# EAGLE design VNT (EAGLE 6.5.0)
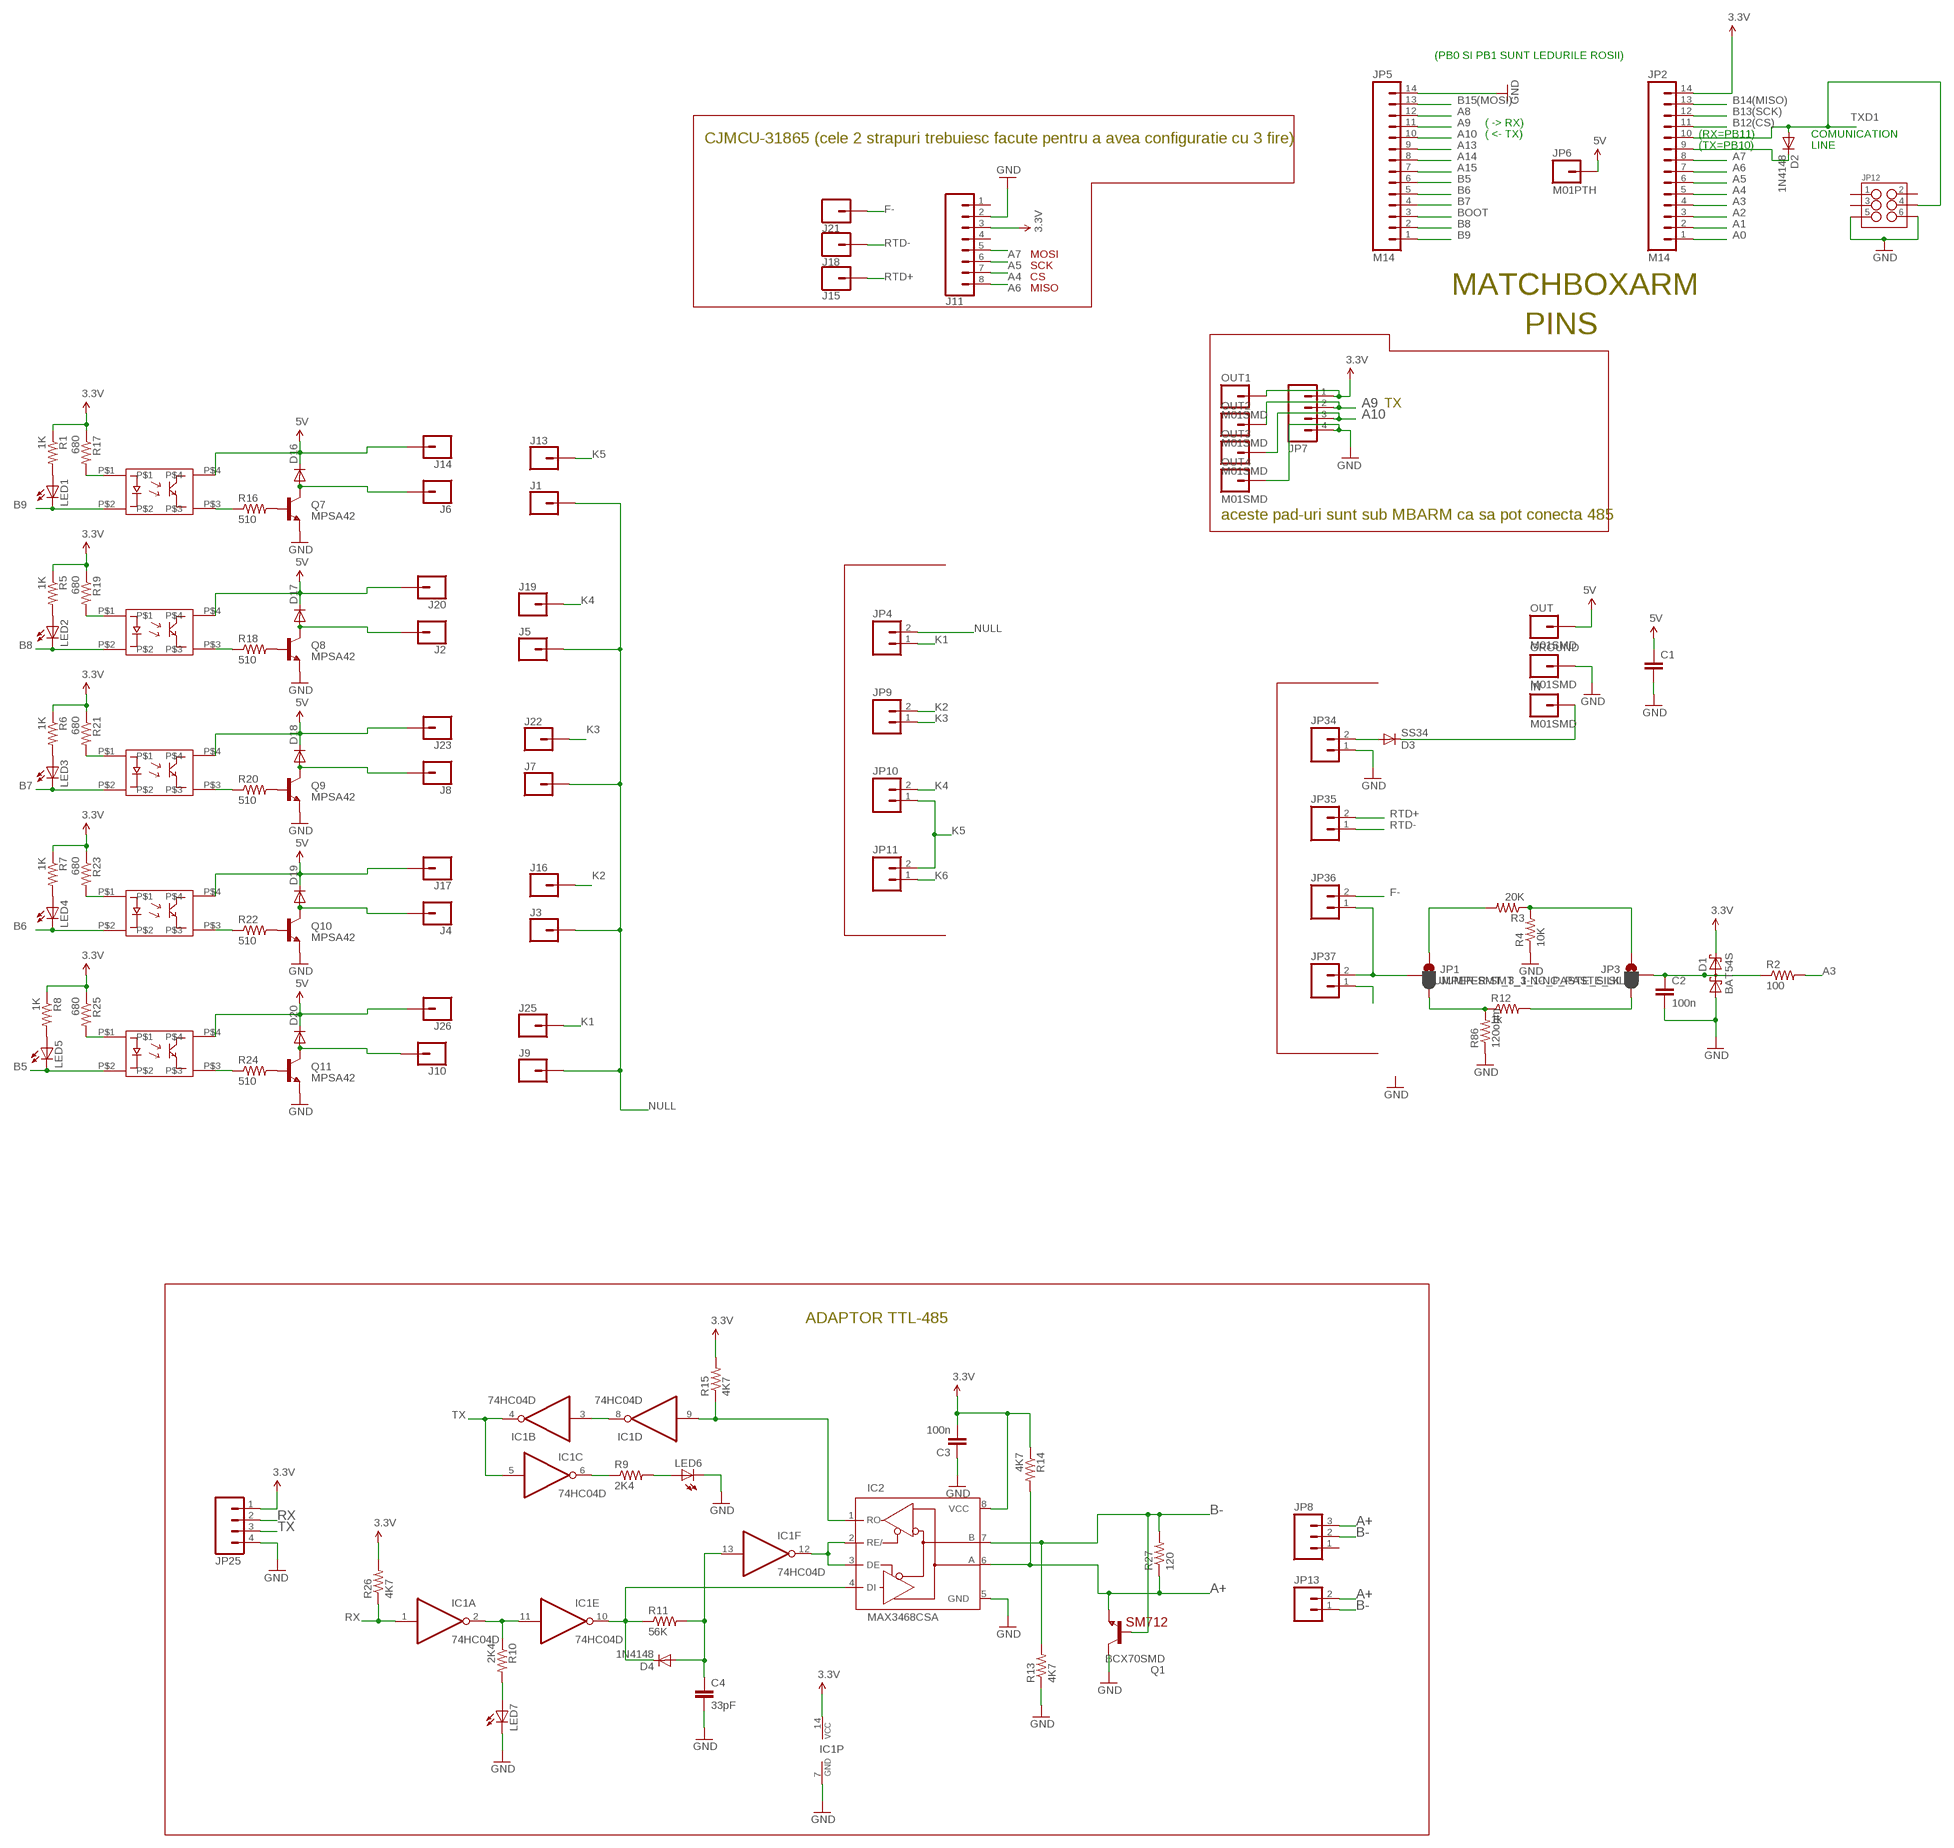
[diagram p0: schematic, sheet 1]

## Parts
C1  CAPPTH1  [CAP-PTH-5MM]
C2  100n  CAP0805  [0805]
C3  100n  CAP0805  [0805]
C4  33pF  CAP0805  [0805]
D1  BAT54S  [SOT23]
D2  1N4148  DIODE-MINIMELF  [MINIMELF]
D3  SS34  DIODE-SMC  [SMC]
D4  1N4148  DIODE-MINIMELF  [MINIMELF]
D16  DIODE-MINIMELF  [MINIMELF]
D17  DIODE-MINIMELF  [MINIMELF]
D18  DIODE-MINIMELF  [MINIMELF]
D19  DIODE-MINIMELF  [MINIMELF]
D20  DIODE-MINIMELF  [MINIMELF]
GROUND  M01SMD  [LUXEON-PAD]
IC1  74HC04D  [SO14]
IC2  MAX3468CSA  [SO08]
IN  M01SMD  [LUXEON-PAD]
J1  CONN_01  [1X01@2]
J2  CONN_01  [1X01@2]
J3  CONN_01  [1X01@2]
J4  CONN_01  [1X01@2]
J5  CONN_01  [1X01@2]
J6  CONN_01  [1X01@2]
J7  CONN_01  [1X01@2]
J8  CONN_01  [1X01@2]
J9  CONN_01  [1X01@2]
J10  CONN_01  [1X01@2]
J11  CONN_08LOCK  [1X08_LOCK]
J13  CONN_01  [1X01@2]
J14  CONN_01  [1X01@2]
J15  CONN_01  [1X01@2]
J16  CONN_01  [1X01@2]
J17  CONN_01  [1X01@2]
J18  CONN_01  [1X01@2]
J19  CONN_01  [1X01@2]
J20  CONN_01  [1X01@2]
J21  CONN_01  [1X01@2]
J22  CONN_01  [1X01@2]
J23  CONN_01  [1X01@2]
J25  CONN_01  [1X01@2]
J26  CONN_01  [1X01@2]
JP1  JUMPER-SMT_3_1-NC_PASTE_SILK  [SMT-JUMPER_3_1-NC_PASTE_SILK]
JP2  M14  [1X14]
JP3  JUMPER-SMT_3_1-NC_PASTE_SILK  [SMT-JUMPER_3_1-NC_PASTE_SILK]
JP4  M025MM  [SCREWTERMINAL-5MM-2]
JP5  M14  [1X14]
JP6  M01PTH  [1X01]
JP7  M04PTH  [1X04]
JP8  M03-SCREW-5MM  [SCREWTERMINAL-5MM-3]
JP9  M025MM  [SCREWTERMINAL-5MM-2]
JP10  M025MM  [SCREWTERMINAL-5MM-2]
JP11  M025MM  [SCREWTERMINAL-5MM-2]
JP12  M03X22X3_SILK_MALE_PTH  [2X3]
JP13  M025MM  [SCREWTERMINAL-5MM-2]
JP25  M04PTH  [1X04]
JP34  M025MM  [SCREWTERMINAL-5MM-2]
JP35  M025MM  [SCREWTERMINAL-5MM-2]
JP36  M025MM  [SCREWTERMINAL-5MM-2]
JP37  M025MM  [SCREWTERMINAL-5MM-2]
LED1  LEDCHIP-LED0805  [CHIP-LED0805]
LED2  LEDCHIP-LED0805  [CHIP-LED0805]
LED3  LEDCHIP-LED0805  [CHIP-LED0805]
LED4  LEDCHIP-LED0805  [CHIP-LED0805]
LED5  LEDCHIP-LED0805  [CHIP-LED0805]
LED6  LEDCHIP-LED0805  [CHIP-LED0805]
LED7  LEDCHIP-LED0805  [CHIP-LED0805]
OUT  M01SMD  [LUXEON-PAD]
OUT1  M01SMD  [LUXEON-PAD]
OUT2  M01SMD  [LUXEON-PAD]
OUT3  M01SMD  [LUXEON-PAD]
OUT4  M01SMD  [LUXEON-PAD]
Q1  BCX70SMD  [SOT23]
Q7  MPSA42  TRANSISTOR_NPNMPSA42  [SOT23-3]
Q8  MPSA42  TRANSISTOR_NPNMPSA42  [SOT23-3]
Q9  MPSA42  TRANSISTOR_NPNMPSA42  [SOT23-3]
Q10  MPSA42  TRANSISTOR_NPNMPSA42  [SOT23-3]
Q11  MPSA42  TRANSISTOR_NPNMPSA42  [SOT23-3]
R1  1K  RESISTOR0805-RES  [0805]
R2  100  RESISTOR0805-RES  [0805]
R3  20K  RESISTOR1206  [1206]
R4  10K  RESISTOR1206  [1206]
R5  1K  RESISTOR0805-RES  [0805]
R6  1K  RESISTOR0805-RES  [0805]
R7  1K  RESISTOR0805-RES  [0805]
R8  1K  RESISTOR0805-RES  [0805]
R9  2K4  RESISTOR0805-RES  [0805]
R10  2K4  RESISTOR0805-RES  [0805]
R11  56K  RESISTOR0805-RES  [0805]
R12  1k  RESISTOR0805-RES  [0805]
R13  4K7  RESISTOR0805-RES  [0805]
R14  4K7  RESISTOR0805-RES  [0805]
R15  4K7  RESISTOR0805-RES  [0805]
R16  510  RESISTOR0805-RES  [0805]
R17  680  RESISTOR0805-RES  [0805]
R18  510  RESISTOR0805-RES  [0805]
R19  680  RESISTOR0805-RES  [0805]
R20  510  RESISTOR0805-RES  [0805]
R21  680  RESISTOR0805-RES  [0805]
R22  510  RESISTOR0805-RES  [0805]
R23  680  RESISTOR0805-RES  [0805]
R24  510  RESISTOR0805-RES  [0805]
R25  680  RESISTOR0805-RES  [0805]
R26  4K7  RESISTOR0805-RES  [0805]
R27  120  RESISTOR0805-RES  [0805]
R86  120ohm  RESISTOR2010  [R2010]
U$13  IS181D-I  [TLP181-I]
U$14  IS181D-I  [TLP181-I]
U$15  IS181D-I  [TLP181-I]
U$16  IS181D-I  [TLP181-I]
U$17  IS181D-I  [TLP181-I]

## Nets
3.3V: C3.2 D1.2(C2) IC1.14(P:VCC) IC2.8(VCC) J11.3 JP2.14 JP7.1 JP25.1 OUT1.P$1 R1.1 R5.1 R6.1 R7.1 R8.1 R14.1 R15.2 R17.1 R19.1 R21.1 R23.1 R25.1 R26.2
5V: C1.1 D16.C D17.C D18.C D19.C D20.C J14.1 J17.1 J20.1 J23.1 J26.1 JP6.1 OUT.P$1 U$13.P$4 U$14.P$4 U$15.P$4 U$16.P$4 U$17.P$4
A0: JP2.1
A1: JP2.2
A2: JP2.3
A3: JP2.4 R2.2
A4: J11.7 JP2.5
A5: J11.6 JP2.6
A6: J11.8 JP2.7
A7: J11.5 JP2.8
A8: JP5.12
A9: JP5.11 JP7.2 OUT2.P$1
A10: JP5.10 JP7.3 OUT3.P$1
A13: JP5.9
A14: JP5.8
A15: JP5.7
A+: IC2.6(A) JP8.3 JP13.2 Q1.2(E) R14.2 R27.1
B5: JP5.6 LED5.C U$17.P$2
B6: JP5.5 LED4.C U$16.P$2
B7: JP5.4 LED3.C U$15.P$2
B8: JP5.2 LED2.C U$13.P$2
B9: JP5.1 LED1.C U$14.P$2
B12(CS): JP2.11
B13(SCK): JP2.12
B14(MISO): JP2.13
B15(MOSI): JP5.13
B-: IC2.7(B) JP8.2 JP13.1 Q1.1(B) R13.2 R27.2
BOOT: JP5.3
F-: J21.1 JP36.2
GND: C1.2 C2.2 C3.1 C4.2 D1.1(A1) GROUND.P$1 IC1.7(P:GND) IC2.5(GND) J11.2 JP5.14 JP7.4 JP12.5 JP12.6 JP25.4 JP34.1 LED6.C LED7.C OUT4.P$1 Q1.3(C) Q7.2(E) Q8.2(E) Q9.2(E) Q10.2(E) Q11.2(E) R4.1 R13.1 R86.1
K1: J25.1 JP4.1
K2: J16.1 JP9.2
K3: J22.1 JP9.1
K4: J19.1 JP10.2
K5: J13.1 JP10.1 JP11.2
K6: JP11.1
N$1: LED1.A R1.2
N$2: LED2.A R5.2
N$3: LED3.A R6.2
N$4: D3.A JP34.2
N$5: JP3.3 R12.2
N$6: JP3.1 R3.1 R4.2
N$7: C2.1 D1.3(C1A2) JP3.2 R2.1
N$8: JP1.1 R3.2
N$9: LED4.A R7.2
N$10: LED5.A R8.2
N$11: D3.C IN.P$1
N$12: JP37.1
N$16: LED7.A R10.2
N$17: LED6.A R9.2
N$19: IC1.2(A:O) IC1.11(E:I) R10.1
N$21: IC1.9(D:I) IC2.1(RO) R15.1
N$22: JP1.2 JP36.1 JP37.2
N$23: IC1.3(B:I) IC1.8(D:O)
N$24: C4.1 D4.A IC1.13(F:I) R11.2
N$27: IC1.6(C:O) R9.1
N$29: D4.C IC1.10(E:O) IC2.4(DI) R11.1
N$30: IC1.12(F:O) IC2.2(RE/) IC2.3(DE)
N$53: Q7.1(B) R16.2
N$54: D16.A J6.1 Q7.3(C)
N$55: Q8.1(B) R18.2
N$56: D17.A J2.1 Q8.3(C)
N$57: Q9.1(B) R20.2
N$58: D18.A J8.1 Q9.3(C)
N$59: Q10.1(B) R22.2
N$60: D19.A J4.1 Q10.3(C)
N$61: Q11.1(B) R24.2
N$62: D20.A J10.1 Q11.3(C)
N$77: R16.1 U$14.P$3
N$78: R17.2 U$14.P$1
N$80: R18.1 U$13.P$3
N$81: R20.1 U$15.P$3
N$82: R22.1 U$16.P$3
N$83: R24.1 U$17.P$3
N$85: R19.2 U$13.P$1
N$87: R21.2 U$15.P$1
N$89: R23.2 U$16.P$1
N$91: R25.2 U$17.P$1
N$104: JP1.3 R12.1 R86.2
NULL: J1.1 J3.1 J5.1 J7.1 J9.1 JP4.2
RTD+: J15.1 JP35.2
RTD-: J18.1 JP35.1
RX: IC1.1(A:I) JP25.2 R26.1
RXD1: D2.C JP2.9
TX: IC1.4(B:O) IC1.5(C:I) JP25.3
TXD1: D2.A JP2.10 JP12.4
Unconnected: J11.1 J11.4 JP8.1 JP12.1 JP12.2 JP12.3

## Notes on the sheet
- (PB0 SI PB1 SUNT LEDURILE ROSII)
- ( -> RX)
- ( <- TX) | (RX=PB11) | COMUNICATION
- CJMCU-31865 (cele 2 strapuri trebuiesc facute pentru a avea configuratie cu 3 fire)
- (TX=PB10) | LINE
- MOSI
- SCK
- CS
- MISO
- MATCHBOXARM
- PINS
- TX
- aceste pad-uri sunt sub MBARM ca sa pot conecta 485
- ADAPTOR TTL-485
- SM712

## Library data of the parts
C1-C4 = SparkFun-Passives:CAP: Capacitor Standard 0603 ceramic capacitor, and 0.1" leaded capacitor.
D1 = diode:BAT54S: Schottky Diodes Pin connection corrected 2011-05-04 Source: Fairchild .. BAT54.pdf
D2-D4 = diode:DIODE-: DIODE
D16-D20 = diode_NEDELCU:DIODE-: DIODE
GROUND IN JP6 OUT OUT1-OUT4 = SparkFun-Connectors:M01: Header 1 Standard 1-pin 0.1" header. Use with straight break away headers (SKU : PRT-00116), right angle break away headers (PRT-00553), swiss pins (PRT-00743), machine pins (PRT-00117), and female headers (PRT-00115).
IC1 = 74xx-eu:74*04: Hex INVERTER
IC2 = maxim:MAX34*: +5V, Fail-Safe, 40Mbps, Profibus RS-485/RS-422 Transceivers Source: MAX3465-MAX3469.pdf; MPN: MAX3468CSA+; OC_FARNELL: unknown; OC_NEWARK: 76K6721
J1-J10 J13-J23 J25 J26 = SparkFun-Connectors:CONN_01: Single connection point. Often used as Generic Header-pin footprint for 0.1 inch spaced/style header connections On any of the 0.1 inch spaced packages, you can populate with these: Break Away Headers - Straight <https://www.sparkfun.com/products/116> (PRT-00116) Break Away Male Headers - Right Angle <https://www.sparkfun.com/products/553> (PRT-00553) Female Headers <https://www.sparkfun.com/products/115> (PRT-00115) Break Away Headers - Machine Pin <https://www.sparkfun.com/products/117> (PRT-00117) Break Away Female Headers - Swiss Machine Pin <https://www.sparkfun.com/products/743> (PRT-00743) This device is also useful as a general connection point to wire up your design to another part of your project. Our various solder wires solder well into these plated through hole pads. Hook-Up Wire - Assortment (Stranded, 22 AWG) <https://www.sparkfun.com/products/11375> (PRT-11375) Hook-Up Wire - Assortment (Solid Core, 22 AWG) <https://www.sparkfun.com/products/11367> (PRT-11367) View the entire wire category on our website here <https://www.sparkfun.com/categories/141> Special notes: SMTSO-256-ET is a "flush mount" nut for a 4-40 screw. We mostly use this on specialty testbeds; it is a nice way to connect hardware to your PCB at an adjustable hieght. Also note, the SNAP packages are for using a snappable style connector. We sell a baggie of snaps and they are also used on two LilyPad designs: Snap Assortment - 30 pack (male and female) <https://www.sparkfun.com/products/11347> (DEV-11347) LilyPad Arduino SimpleSnap <https://www.sparkfun.com/products/10941> (DEV-10941) LilyPad SimpleSnap Protoboard <https://www.sparkfun.com/products/10940> (DEV-10940)
J11 = SparkFun-Connectors:CONN_08: Multi connection point. Often used as Generic Header-pin footprint for 0.1 inch spaced/style header connections On any of the 0.1 inch spaced packages, you can populate with these: Break Away Headers - Straight <https://www.sparkfun.com/products/116> (PRT-00116) Break Away Male Headers - Right Angle <https://www.sparkfun.com/products/553> (PRT-00553) Female Headers <https://www.sparkfun.com/products/115> (PRT-00115) Break Away Headers - Machine Pin <https://www.sparkfun.com/products/117> (PRT-00117) Break Away Female Headers - Swiss Machine Pin <https://www.sparkfun.com/products/743> (PRT-00743) Arduino Stackable Header - 8 Pin <https://www.sparkfun.com/products/9279> (PRT-09279) For SCREWTERMINALS and SPRING TERMINALS visit here: Screw Terimnals on SparkFun.com <https://www.sparkfun.com/search/results?term=Screw+Terminals> (5mm/3.5mm/2.54mm spacing) This device is also useful as a general connection point to wire up your design to another part of your project. Our various solder wires solder well into these plated through hole pads. Hook-Up Wire - Assortment (Stranded, 22 AWG) <https://www.sparkfun.com/products/11375> (PRT-11375) Hook-Up Wire - Assortment (Solid Core, 22 AWG) <https://www.sparkfun.com/products/11367> (PRT-11367) View the entire wire category on our website here <https://www.sparkfun.com/categories/141> Special notes: Molex polarized connector foot print use with SKU : PRT-08231 with associated crimp pins and housings. 1MM SMD Version SKU: PRT-10208 NOTES ON THE VARIANTS LOCK and LOCK_LONGPADS... This footprint was designed to help hold the alignment of a through-hole component (i.e. 6-pin header) while soldering it into place. You may notice that each hole has been shifted either up or down by 0.005 of an inch from it's more standard position (which is a perfectly straight line). This slight alteration caused the pins (the squares in the middle) to touch the edges of the holes. Because they are alternating, it causes a "brace" to hold the component in place. 0.005 has proven to be the perfect amount of "off-center" position when using our standard breakaway headers. Although looks a little odd when you look at the bare footprint, once you have a header in there, the alteration is very hard to notice. Also,if you push a header all the way into place, it is covered up entirely on the bottom side.
JP1 JP3 = SparkFun-Jumpers:JUMPER-SMT_3_1-NC_PASTE: Normally closed solder jumper (1 of 2 connections) This jumper has an aperture in the stencil to allow solder paste to bridge one of the two connections. One connection is normally closed (NC), while the other is normally open (NO). Wick off the solder to open the connection. Reapply solder to reclose the connection. Apply solder to the other side instead to change the current path.
JP2 JP5 = SparkFun-Connectors:M14: Header 14 Standard 14-pin 0.1" header. Use with straight break away headers (SKU : PRT-00116), right angle break away headers (PRT-00553), swiss pins (PRT-00743), machine pins (PRT-00117), and female headers (PRT-00115).
JP4 JP9-JP11 JP13 JP34-JP37 = SparkFun-Connectors:M02: Header 2 Standard 2-pin 0.1" header. Use with straight break away headers (SKU : PRT-00116), right angle break away headers (PRT-00553), swiss pins (PRT-00743), machine pins (PRT-00117), and female headers (PRT-00115). Molex polarized connector foot print use with SKU : PRT-08233 with associated crimp pins and housings.
JP7 JP25 = SparkFun-Connectors:M04: Header 4 Standard 4-pin 0.1" header. Use with straight break away headers (SKU : PRT-00116), right angle break away headers (PRT-00553), swiss pins (PRT-00743), machine pins (PRT-00117), and female headers (PRT-00115). Molex polarized connector foot print use with SKU : PRT-08231 with associated crimp pins and housings. 1MM SMD Version SKU: PRT-10208
JP8 = SparkFun-Connectors:M03: Header 3 Standard 3-pin 0.1" header. Use with straight break away headers (SKU : PRT-00116), right angle break away headers (PRT-00553), swiss pins (PRT-00743), machine pins (PRT-00117), and female headers (PRT-00115). Molex polarized connector foot print use with SKU : PRT-08232 with associated crimp pins and housings.; STOREFRONT_ID: PRT-08433
JP12 = SparkFun-Connectors:M03X2: 2x3 .1" header. Shrouded, with keying- CONN-10681 SMT- CONN-11415 Pogo pins- HW-11044; PROD_ID: CONN-09701
LED1-LED7 = led:LED: LED OSRAM: - CHIPLED LG R971, LG N971, LY N971, LG Q971, LY Q971, LO R971, LY R971 LH N974, LH R974 LS Q976, LO Q976, LY Q976 LO Q996 - Hyper CHIPLED LW Q18S LB Q993, LB Q99A, LB R99A - SideLED LS A670, LO A670, LY A670, LG A670, LP A670 LB A673, LV A673, LT A673, LW A673 LH A674 LY A675 LS A676, LA A676, LO A676, LY A676, LW A676 LS A679, LY A679, LG A679 - Hyper Micro SIDELED® LS Y876, LA Y876, LO Y876, LY Y876 LT Y87S - SmartLED LW L88C, LW L88S LB L89C, LB L89S, LG L890 LS L89K, LO L89K, LY L89K LS L896, LA L896, LO L896, LY L896 - TOPLED LS T670, LO T670, LY T670, LG T670, LP T670 LSG T670, LSP T670, LSY T670, LOP T670, LYG T670 LG T671, LOG T671, LSG T671 LB T673, LV T673, LT T673, LW T673 LH T674 LS T676, LA T676, LO T676, LY T676, LB T676, LH T676, LSB T676, LW T676 LB T67C, LV T67C, LT T67C, LS T67K, LO T67K, LY T67K, LW E67C LS E67B, LA E67B, LO E67B, LY E67B, LB E67C, LV E67C, LT E67C LW T67C LS T679, LY T679, LG T679 LS T770, LO T770, LY T770, LG T770, LP T770 LB T773, LV T773, LT T773, LW T773 LH T774 LS E675, LA E675, LY E675, LS T675 LS T776, LA T776, LO T776, LY T776, LB T776 LHGB T686 LT T68C, LB T68C - Hyper Mini TOPLED® LB M676 - Mini TOPLED Santana® LG M470 LS M47K, LO M47K, LY M47K Source: http://www.osram.convergy.de LUXEON: - LUMILED® LXK2-PW12-R00, LXK2-PW12-S00, LXK2-PW14-U00, LXK2-PW14-V00 LXK2-PM12-R00, LXK2-PM12-S00, LXK2-PM14-U00 LXK2-PE12-Q00, LXK2-PE12-R00, LXK2-PE12-S00, LXK2-PE14-T00, LXK2-PE14-U00 LXK2-PB12-K00, LXK2-PB12-L00, LXK2-PB12-M00, LXK2-PB14-N00, LXK2-PB14-P00, LXK2-PB14-Q00 LXK2-PR12-L00, LXK2-PR12-M00, LXK2-PR14-Q00, LXK2-PR14-R00 LXK2-PD12-Q00, LXK2-PD12-R00, LXK2-PD12-S00 LXK2-PH12-R00, LXK2-PH12-S00 LXK2-PL12-P00, LXK2-PL12-Q00, LXK2-PL12-R00 Source: www.luxeon.com KINGBRIGHT: KA-3528ASYC Source: www.kingbright.com
Q1 = transistor-npn:BCX70*: NPN Transistor
Q7-Q11 = SparkFun-DiscreteSemi:TRANSISTOR_NPN: Generic NPN BJT MMBT2222A - TRANS-08049 (SOT-23, 1A 40V) MPSA42 - TRANS-09116 (SOT-23, 500mA 300V) MMBT5088LT1G - TRANS-11160 (SOT-23, 50 mA 30V) BC547 - COM-08928 <http://www.sparkfun.com/products/8928> (TO-92 45V 100mA) (1.Collector 2.Base 3.Emitter) 2N3904 - COM-00521 <http://www.sparkfun.com/products/521> (TO-92 40V 200mA) (1.Emitter 2.Base 3.Collector) P2N2222A - COM-12852 <http://www.sparkfun.com/products/12852> (TO-92 40V 600mA) (1.Collector 2.Base 3.Emitter); PROD_ID: TRANS-09116
R1-R27 R86 = SparkFun-Passives:RESISTOR: Resistor Basic schematic elements and footprints for 0603, 1206, and PTH resistors.
U$13-U$17 = IS181-I:IS181D-I

## Board
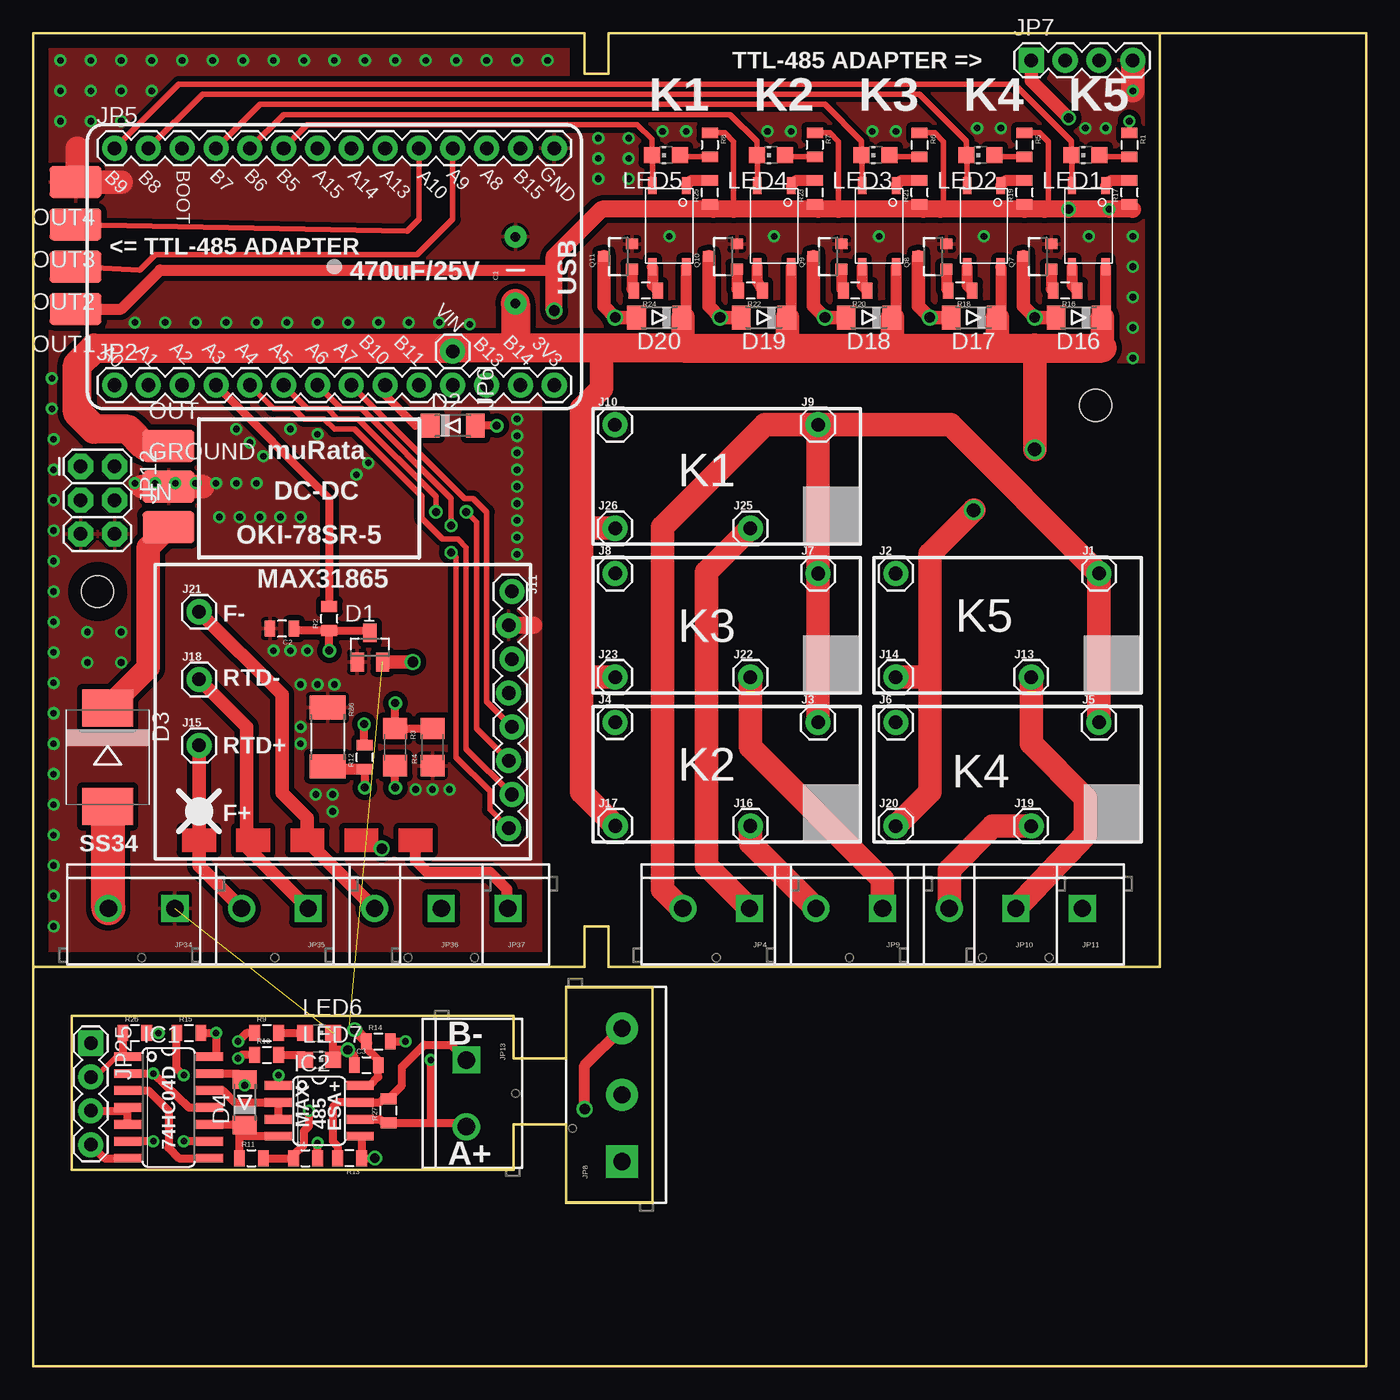
[diagram p1: board, top side]
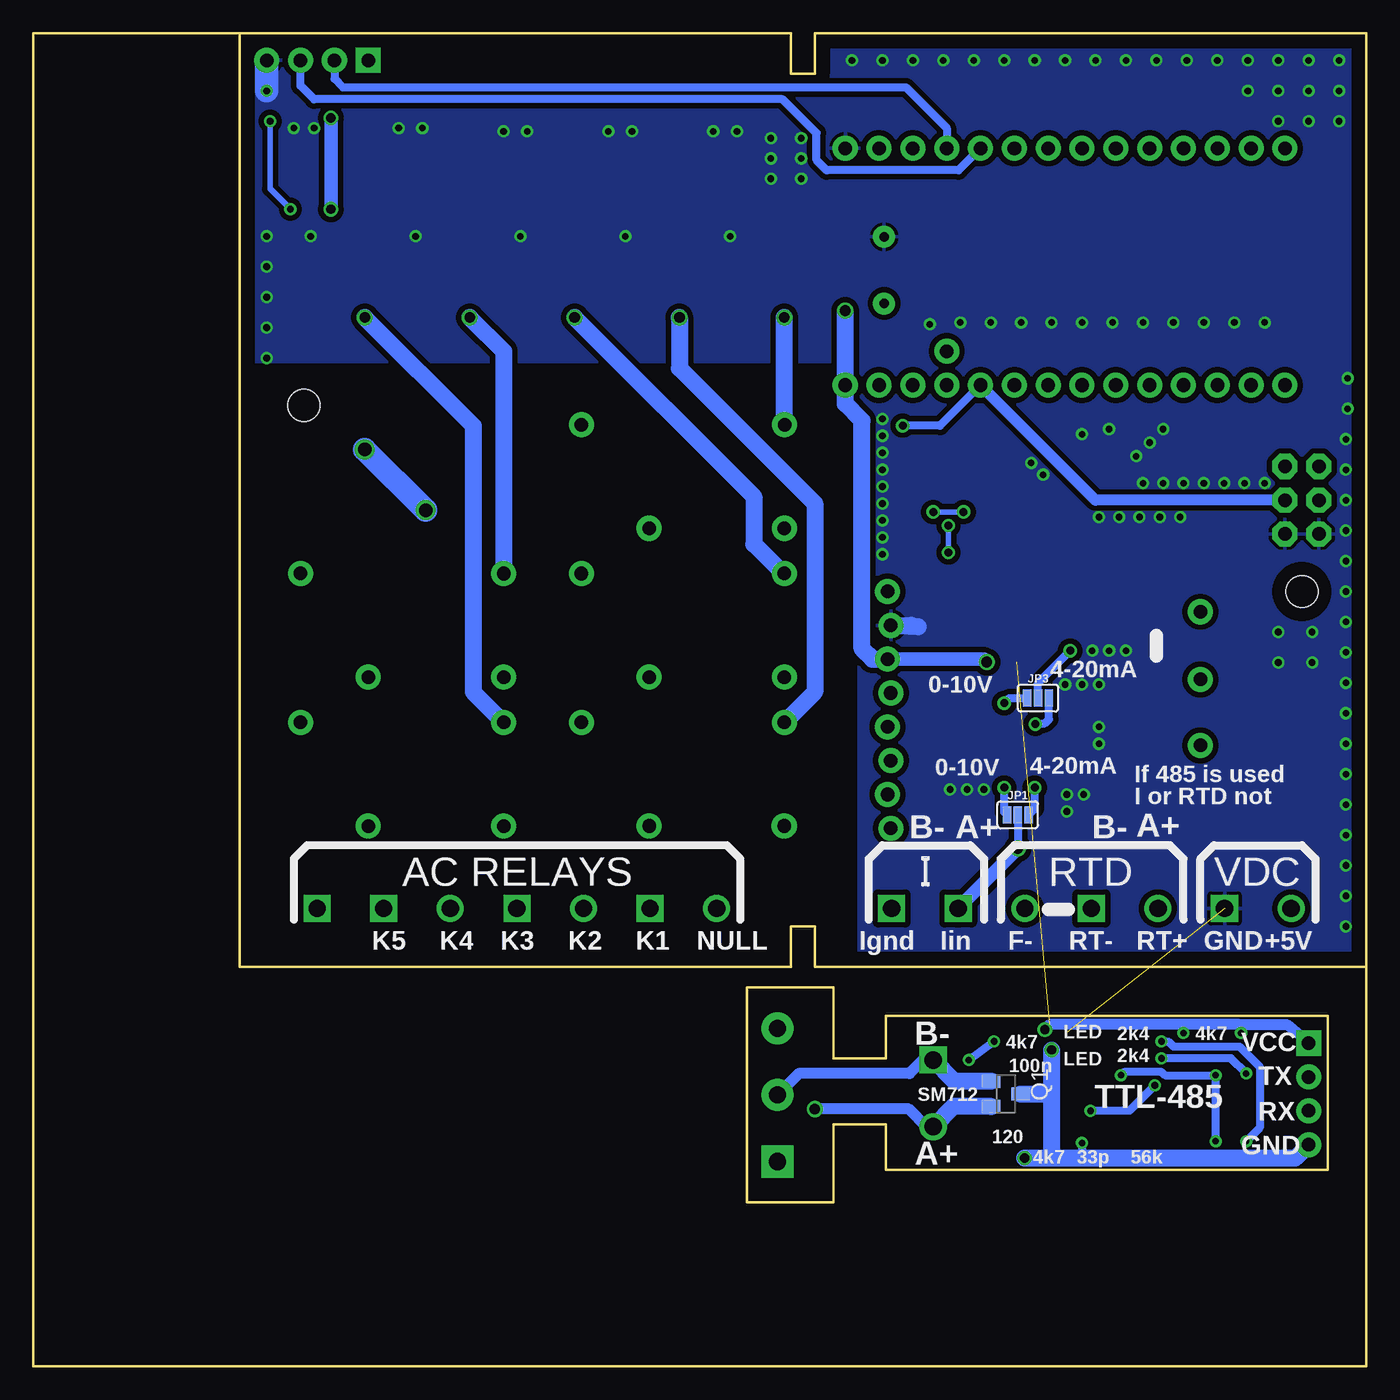
[diagram p2: board, bottom side, seen from below]

Size 100.08 x 100.08 mm. Coordinates in mm from the lower left corner, seen from the top.
Outline: 0,29.97 0,100.08 41.4,100.08 41.4,97.03 43.18,97.03 43.18,100.08 84.58,100.08
Outline: 0,29.97 41.4,29.97 41.4,33.02 43.18,33.02 43.18,29.97 84.58,29.97 84.58,100.08
Outline: 0,29.97 0,0 100.08,0 100.08,100.08 84.58,100.08
Outline: 40.01,23.11 36.07,23.11 36.07,26.29 2.9,26.29 2.9,14.73 36.07,14.73 36.07,18.16 40.01,18.16 40.01,12.32 46.48,12.32 46.48,28.45 40.01,28.45 40.01,23.11
Copper layers (1*16): Top 0.035mm / dielectric 1.5mm / Bottom 0.035mm
Design rules "default *": minimum track width 10mil, minimum drill 24mil, track to track 8mil, track to pad 8mil, pad to pad 8mil, via to via 8mil, smd to smd 8mil, copper to edge 40mil, drill to drill 8mil, minimum pad ring 10mil, minimum via ring 8mil, stop-mask expansion 4mil, vias tented up to drill 24mil, thermal gap 10mil
Holes 2.4 mm at 4.83,58.17 79.76,72.14

### Footprints (pad centres in the part's own frame; a part is rotated, then mirrored left to right if it is on the bottom)
CAP-PTH-5MM = drill 0.7 pad 1.651: 1 -2.5,0; 2 2.5,0
0805 = smd 0.8 x 1.2: 1 -0.9,0; 2 0.9,0
SOT23 = smd 1 x 1.4: 1 -0.95,-1.1; 2 0.95,-1.1; 3 0,1.1
MINIMELF = smd 1.4 x 1.8: A 1.7,0; C -1.7,0
SMC = smd 2.8 x 3.8: A 3.7,0; C -3.7,0
LUXEON-PAD = smd 3.9 x 2.4: P$1 0,0
SO14 = smd 0.66 x 2.032: 1 -3.81,-3.073; 2 -2.54,-3.073; 3 -1.27,-3.073; 4 0,-3.073; 5 1.27,-3.073; 6 2.54,-3.073; 7 3.81,-3.073; 8 3.81,3.073; 9 2.54,3.073; 10 1.27,3.073; 11 0,3.073; 12 -1.27,3.073; 13 -2.54,3.073; 14 -3.81,3.073
SO08 = smd 0.66 x 2.032: 1 -1.905,-3.073; 2 -0.635,-3.073; 3 0.635,-3.073; 4 1.905,-3.073; 5 1.905,3.073; 6 0.635,3.073; 7 -0.635,3.073; 8 -1.905,3.073
1X01@2 = drill 1.016 pad 1.88: 1 0,0
1X08_LOCK = drill 1.016 pad 1.88: 1 0,0.127; 2 2.54,-0.127; 3 5.08,0.127; 4 7.62,-0.127; 5 10.16,0.127; 6 12.7,-0.127; 7 15.24,0.127; 8 17.78,-0.127
SMT-JUMPER_3_1-NC_PASTE_SILK = smd 0.635 x 1.27: 1 -0.813,0; 2 0,0; 3 0.813,0
1X14 = drill 1.016 pad 1.88: 1 0,0; 2 2.54,0; 3 5.08,0; 4 7.62,0; 5 10.16,0; 6 12.7,0; 7 15.24,0; 8 17.78,0; 9 20.32,0; 10 22.86,0; 11 25.4,0; 12 27.94,0; 13 30.48,0; 14 33.02,0
SCREWTERMINAL-5MM-2 = drill 1.3 pad 2.032 square: 1 0,0 | drill 1.3 pad 2.032: 2 5,0
1X01 = drill 1.016 pad 1.88: 1 0,0
1X04 = drill 1.016 pad 1.88 square: 1 0,0 | drill 1.016 pad 1.88: 2 2.54,0; 3 5.08,0; 4 7.62,0
SCREWTERMINAL-5MM-3 = drill 1.3 pad 2.413 square: 1 0,0 | drill 1.3 pad 2.413: 2 5,0; 3 10,0
2X3 = drill 1.016 pad 1.88 octagon: 1 0,0; 2 0,2.54; 3 2.54,0; 4 2.54,2.54; 5 5.08,0; 6 5.08,2.54
CHIP-LED0805 = smd 1.2 x 1.2: A 0,-1.05; C 0,1.05
SOT23-3 = smd 0.8 x 0.9: 1 -0.95,-1; 2 0.95,-1; 3 0,1.1
1206 = smd 1.6 x 1.8: 1 -1.4,0; 2 1.4,0
R2010 = smd 1.8 x 2.7: 1 -2.2,0; 2 2.2,0
TLP181-I = smd 1.27 x 0.635: P$1 -3.048,1.27; P$2 -3.048,-1.27; P$3 3.048,-1.27; P$4 3.048,1.27

### Placement (x,y rotation side)
C1  36.2,82.3 90 top
C2  18.67,55.37 180 top
C3  25.02,22.61 0 top
C4  20.45,15.62 0 top
D1  25.27,53.98 0 top
D2  31.5,70.61 0 top
D3  5.59,45.72 270 top
D4  15.88,19.81 90 top
D16  78.49,78.74 180 top
D17  70.61,78.74 180 top
D18  62.74,78.74 180 top
D19  54.86,78.74 180 top
D20  46.99,78.74 180 top
GROUND  10.16,66.04 0 top
IC1  10.16,19.43 270 top
IC2  21.46,19.18 270 top
IN  10.16,62.99 0 top
J1  80.02,59.52 0 top
J2  64.77,59.51 0 top
J3  58.92,48.34 0 top
J4  43.69,48.35 0 top
J5  80.01,48.34 0 top
J6  64.77,48.34 0 top
J7  58.93,59.51 0 top
J8  43.69,59.52 0 top
J9  58.92,70.69 0 top
J10  43.67,70.69 0 top
J11  35.81,58.17 270 top
J13  74.92,51.74 0 top
J14  64.76,51.74 0 top
J15  12.45,46.61 0 top
J16  53.84,40.56 0 top
J17  43.7,40.56 0 top
J18  12.45,51.56 0 top
J19  74.92,40.56 0 top
J20  64.76,40.56 0 top
J21  12.45,56.64 0 top
J22  53.84,51.74 0 top
J23  43.69,51.74 0 top
J25  53.84,62.91 0 top
J26  43.69,62.91 0 top
JP1  26.16,41.4 0 bottom
JP2  6.1,73.66 0 top
JP3  24.64,50.16 0 bottom
JP4  53.77,34.37 180 top
JP5  6.1,91.44 0 top
JP6  31.5,76.2 270 top
JP7  74.93,98.04 0 top
JP8  44.2,15.37 90 top
JP9  63.77,34.37 180 top
JP10  73.77,34.37 180 top
JP11  78.77,34.37 180 top
JP12  3.56,67.56 270 top
JP13  32.51,22.99 270 top
JP25  4.32,24.26 270 top
JP34  10.63,34.37 180 top
JP35  20.63,34.37 180 top
JP36  30.63,34.37 180 top
JP37  35.63,34.37 180 top
LED1  78.99,90.93 90 top
LED2  71.12,90.93 90 top
LED3  63.25,90.93 90 top
LED4  55.37,90.93 90 top
LED5  47.5,90.93 90 top
LED6  21.46,25.02 270 top
LED7  21.46,22.99 270 top
OUT  10.16,69.09 0 top
OUT1  3.17,79.38 180 top
OUT2  3.17,82.55 180 top
OUT3  3.17,85.72 180 top
OUT4  3.17,88.9 180 top
Q1  27.05,20.45 270 bottom
Q7  75.44,83.31 90 top
Q8  67.56,83.31 90 top
Q9  59.69,83.31 90 top
Q10  51.82,83.31 90 top
Q11  43.94,83.31 90 top
R1  82.3,91.69 270 top
R2  22.23,56.13 90 top
R3  27.18,46.48 270 top
R4  29.97,46.48 90 top
R5  74.42,91.69 270 top
R6  66.55,91.69 270 top
R7  58.67,91.69 270 top
R8  50.8,91.69 270 top
R9  17.53,25.02 0 top
R10  17.53,23.37 0 top
R11  16.38,15.62 0 top
R12  24.89,45.72 90 top
R13  23.75,15.62 180 top
R14  25.91,24.38 0 top
R15  11.68,25.02 0 top
R16  77.47,80.77 180 top
R17  82.3,88.14 90 top
R18  69.6,80.77 180 top
R19  74.42,88.14 90 top
R20  61.72,80.77 180 top
R21  66.55,88.14 90 top
R22  53.85,80.77 180 top
R23  58.67,88.14 90 top
R24  45.97,80.77 180 top
R25  50.8,88.14 90 top
R26  7.62,25.02 0 top
R27  26.67,19.18 90 top
R86  22.1,47.24 270 top
U$13  71.37,85.6 270 top
U$14  79.25,85.6 270 top
U$15  63.5,85.6 270 top
U$16  55.63,85.6 270 top
U$17  47.75,85.6 270 top

### Tracks (layer width: path | path; a pad name or v marks a point on that pad's centre or on a via)
3.3V  (via drill 0.5, 0.7, 0.8)  (1 unrouted)
  Top 0.406: R8.1 51.93,92.59 52.58,91.95 52.58,86.87 | R5.1 75.55,92.59 76.2,91.95 76.2,87.12 75.95,86.87 | R7.1 59.81,92.59 60.45,91.95 60.45,86.87 | R6.1 67.68,92.59 68.33,91.95 68.33,87.12 68.07,86.87 | R1.1 v82.3,93.47
  Top 0.61: R15.2 v13.72,25.02 13.72,23.24 IC1.14 | R26.2 v9.4,25.02 | IC2.8 25.27,21.08 25.91,21.72 25.91,22.59 C3.2 25.92,22.98 25.15,23.75 25.15,24.25 R14.1 25.01,24.39
  Top 0.813: R19.1 74.42,86.87 | R17.1 82.55,86.87 | R21.1 66.8,86.87 | R23.1 58.93,86.87 | R25.1 51.05,86.87 | 25.01,24.39 v24.13,25.27 | OUT1.P$1 6.6,79.38 9.53,82.3 39.12,82.3
  Top 1.016: D1.2 v28.49,52.88 | JP7.1 74.93,96.52 v77.72,93.73
  Top 1.27: 82.55,86.87 v80.77,86.87 v77.72,86.87 75.95,86.87 74.42,86.87 68.07,86.87 66.8,86.87 60.45,86.87 58.93,86.87 52.58,86.87 51.05,86.87 42.67,86.87 39.12,83.31 39.12,82.3 v39.12,79.25
  Bottom 0.406: v82.3,93.47 82.3,88.39 v80.77,86.87
  Bottom 0.61: v13.72,25.02 13.72,25.65 | v9.4,25.02 9.4,25.65 9.53,25.65
  Bottom 0.813: v24.13,25.27 23.75,25.65 13.72,25.65 9.53,25.65 5.97,25.65 JP25.1
  Bottom 1.016: v28.49,52.88 28.7,53.09 J11.3 | v77.72,93.73 v77.72,86.87
  Bottom 1.27: JP2.14 v39.12,79.25 | JP2.14 38.86,73.53 | J11.3 37.08,53.09 37.85,53.85 37.85,70.99 39.12,72.26 JP2.14
5V  (via drill 1)
  Top 0.813: U$13.P$4 72.64,78.74 72.39,78.74 | 80.26,78.74 80.52,78.74 U$14.P$4 | U$16.P$4 56.9,78.74 56.64,78.74 | U$17.P$4 49.02,78.74 48.77,78.74 | U$15.P$4 64.77,78.74 64.52,78.74
  Top 1.27: D20.C 48.77,78.74 | D19.C 56.64,78.74 | D18.C 64.52,78.74 | 72.39,78.74 D17.C | D16.C 80.26,78.74
  Top 1.778: 80.26,76.45 80.26,78.74 | 72.39,78.74 72.39,76.45 | 64.52,78.74 64.52,76.45 | 48.77,78.74 48.77,76.45 | 56.64,78.74 56.64,76.45 | JP6.1 31.24,76.45 | 8.38,69.09 OUT.P$1 | J17.1 41.15,43.11 41.15,51.82 | 41.15,51.82 41.15,62.74 | 41.15,62.74 41.15,71.88 42.67,73.41 42.67,76.45 | J26.1 41.32,62.91 41.15,62.74 | J23.1 41.23,51.74 41.15,51.82 | J20.1 67.31,43.11 67.31,51.74 | 67.31,51.74 67.31,60.96 v70.61,64.26 | J14.1 67.31,51.74 | v75.18,68.83 75.18,76.45
  Top 2.184: 80.26,76.45 75.18,76.45 72.39,76.45 64.52,76.45 56.64,76.45 48.77,76.45 42.67,76.45 36.58,76.45 | 36.58,76.45 31.24,76.45 4.57,76.45 3.3,75.18 3.3,71.63 4.57,70.36 7.11,70.36 8.38,69.09 | C1.1 36.2,76.83 36.58,76.45
  Bottom 1.778: v70.61,64.26 v75.18,68.83
A3
  Top 0.61: JP2.4 22.23,65.15 R2.2
A4
  Top 0.406: J11.7 32.51,46.35 32.51,61.47 31.88,62.1 30.73,62.1 29.21,63.63 29.21,65.28 24.13,70.36 22.61,70.36 21.84,71.12 20.32,71.12 19.56,71.88 18.03,71.88 JP2.5
A5  (via drill 0.6)
  Top 0.406: J11.6 33.27,47.88 33.27,63.37 v32.51,64.14 | v30.23,64.14 30.23,65.28 24.38,71.12 22.86,71.12 22.1,71.88 20.57,71.88 JP2.6
  Bottom 0.406: v30.23,64.14 v32.51,64.14
A6  (via drill 0.6)
  Top 0.406: JP2.7 23.11,71.88 24.64,71.88 31.37,65.15 v31.37,63.12 | v31.37,61.09 31.75,60.71 31.75,45.72 34.29,43.18 34.29,41.78 J11.8
  Bottom 0.406: v31.37,63.12 v31.37,61.09
A7
  Top 0.406: J11.5 34.04,49.91 34.04,64.14 33.02,65.15 32.38,65.15 JP2.8
A9
  Top 0.406: OUT2.P$1 8,82.3 9.14,83.44 28.83,83.44 31.5,86.11 JP5.11
  Bottom 0.61: JP7.2 77.47,96.65 76.83,96.01 34.54,96.01 31.5,92.96 JP5.11
A10
  Top 0.406: OUT3.P$1 28.07,85.22 28.96,86.11 JP5.10
  Bottom 0.61: JP5.10 30.61,89.79 40.51,89.79 41.27,90.55 41.27,92.58 43.81,95.12 78.99,95.12 80.01,96.14 JP7.3
A+  (via drill 0.5, 0.8)
  Top 0.61: IC2.6 26.04,18.54 26.3,18.28 R27.1 29.84,18.28 | 29.84,18.28 32.22,18.28 JP13.2 | R14.2 v27.94,24.38 | v29.84,22.99 29.84,18.28
  Top 0.813: v41.4,19.3 41.4,22.57 JP8.3
  Bottom 0.61: v27.94,24.38 v29.84,22.99
  Bottom 0.813: v41.4,19.3 34.34,19.3 33.02,17.99 JP13.2
  Bottom 1.27: Q1.2 31,19.5 JP13.2
B5
  Top 0.406: JP5.6 20.57,93.22 45.34,93.22 46.45,92.11 LED5.C 46.48,90.93 U$17.P$2
B6
  Top 0.406: JP5.5 18.8,93.98 52.32,93.98 54.32,91.98 LED4.C 54.36,90.93 U$16.P$2
B7
  Top 0.406: JP5.4 17.02,94.74 59.44,94.74 62.2,91.98 LED3.C 62.23,90.93 U$15.P$2
B8
  Top 0.406: JP5.2 12.7,95.5 66.55,95.5 70.07,91.98 LED2.C 70.1,90.68 U$13.P$2
B9
  Top 0.406: JP5.1 10.92,96.27 73.66,96.27 77.94,91.98 LED1.C 77.98,90.68 U$14.P$2
B-
  Top 0.61: R13.2 22.85,16.52 22.48,16.89 22.48,19.43 22.86,19.81 IC2.7 26.04,19.81 26.3,20.08 R27.2 27.69,21.09 27.69,22.48 29.34,24.13 31.37,24.13 JP13.1
  Bottom 0.813: JP13.1 33.27,22.99 34.29,21.97 42.59,21.97 JP8.2
  Bottom 1.27: Q1.1 30.92,21.4 JP13.1
F-
  Top 1.016: J21.1 18.67,50.42 18.67,43.05 20.57,41.15 20.57,39.43 JP36.2
GND  (via drill 0.5, 0.7)  (1 unrouted)
  Top 0.61: C3.1 24.12,23.25 v23.62,23.75 22.51,23.75 | LED7.C 22.51,23.75 | 22.51,23.75 LED6.C | JP25.4 5.33,15.62 IC1.7 | IC2.5 24.65,17.27 R13.1 v25.65,15.62 | C4.2 21.34,15.62 v21.34,16.76
  Top 1.27: 37.59,55.63 35.81,55.63
  Top 1.778: 8.13,66.04 12.7,66.04 | JP7.4 v82.55,95.76 | 3.3,91.44 3.3,89.15 | 4.32,88.9 6.6,88.9
  Bottom 0.61: v21.34,16.76 21.34,15.62 22.1,15.62
  Bottom 1.27: 33.66,55.5 J11.2 34.16,55.63 | JP25.4 5.33,15.62 22.1,15.62 23.62,15.62 | 23.62,15.62 v25.65,15.62 | v23.62,23.75 23.62,20.45 | 23.62,20.45 23.62,15.62 | Q1.3 23.62,20.45
  Bottom 1.778: JP7.4 v82.55,95.76
  other vias: 1.52,67.31 1.52,65.02 1.52,62.74 80.52,92.96 55.12,92.71 62.99,92.71 56.9,92.71 49.02,92.71 72.64,92.96 44.7,89.15 44.7,90.68 44.7,92.2 78.99,92.96 47.24,92.71 64.77,92.71 42.42,92.2 42.42,90.68 42.42,89.15 47.75,84.84 55.63,84.84 63.5,84.84 71.37,84.84 79.25,84.84 19.3,70.36 21.34,69.98 24.26,66.93 25.15,67.82 16.26,69.34 17.27,68.33 15.24,70.36 7.62,78.36 9.91,78.36 12.19,78.36 14.48,78.36 16.76,78.36 19.05,78.36 21.34,78.36 23.62,78.36 25.91,78.36 17.02,63.75 18.54,63.75 20.07,63.75 6.6,55.12 4.06,52.83 6.6,52.83 1.52,55.88 4.06,55.12 1.52,53.59 15.49,63.75 2.03,98.04 4.32,98.04 6.6,98.04 8.89,98.04 11.18,98.04 13.46,98.04 15.75,98.04 18.03,98.04 2.03,95.76 2.03,93.47 4.32,95.76 4.32,93.47 6.6,95.76 6.6,93.47 8.89,95.76 70.87,92.96 20.32,98.04 22.61,98.04 24.89,98.04 27.18,98.04 29.46,98.04 31.75,98.04 34.04,98.04 36.32,98.04 38.61,98.04 82.55,84.84 82.55,82.55 82.55,80.26 82.55,77.98 82.55,75.69 1.52,69.6 1.4,71.88 1.4,74.17 28.19,78.36 30.48,78.36 32.77,78.23 1.52,60.45 1.52,58.17 1.52,51.31 1.52,49.02 1.52,46.74 1.52,44.45 1.52,42.16 1.52,39.88 1.52,37.59 1.52,35.31 1.52,33.02 36.32,68.58 36.32,69.85 36.32,67.31 36.32,71.12 7.62,66.29 9.14,66.29 10.67,66.29 12.19,66.29 13.72,66.29 13.97,63.75 15.24,66.29 16.76,66.29 36.32,66.04 36.32,64.77 36.32,63.5 36.32,62.23 36.32,60.96 20.07,48.01 20.07,46.74 21.21,42.93 22.48,42.93 22.48,41.66 18.03,53.72 19.3,53.72 20.57,53.72 28.7,43.31 29.97,43.31 31.24,43.31 22.61,51.18 21.34,51.18 20.07,51.18
  pour Bottom (isolate 0.406): 0,29.97 38.1,29.97 38.1,75.44 84.58,75.44 84.58,100.08 0,100.08
  pour Top (isolate 0.406): 0,29.97 38.1,29.97 38.1,75.44 84.58,75.44 84.58,100.08 0,100.08
K1
  Top 1.778: J25.1 50.55,59.62 50.55,37.59 JP4.1
K2
  Top 1.778: J16.1 53.84,39.3 JP9.2
K3
  Top 1.778: J22.1 53.84,46.49 63.77,36.56 JP9.1
K4
  Top 1.778: J19.1 72.06,40.56 68.77,37.27 JP10.2
K5
  Top 1.778: J13.1 74.92,46.74 78.99,42.67 78.99,39.88 JP11.2
N$1
  Top 0.406: R1.2 80.18,90.79 LED1.A
N$2
  Top 0.406: R5.2 72.17,90.79 LED2.A
N$3
  Top 0.406: R6.2 64.43,90.79 LED3.A
N$4
  Top 2.54: JP34.2 5.63,41.98 D3.A
N$5  (via drill 0.6)
  Top 0.61: R12.2 24.84,46.67 v24.84,48.21
  Bottom 0.61: v24.84,48.21 24.79,48.26 24.13,48.26 23.82,48.56 JP3.3
N$6  (via drill 0.6)
  Top 0.61: R4.2 R3.1 v27.18,49.78
  Bottom 0.61: v27.18,49.78 26.8,50.16 JP3.1
N$7  (via drill 0.6)
  Top 0.61: R2.1 19.57,55.23 C2.1 | v22.23,53.72 R2.1 | R2.1 25.24,55.23 D1.3
  Bottom 0.61: JP3.2 24.64,51.31 v22.23,53.72
N$8  (via drill 0.6)
  Top 0.61: v27.18,43.43 R3.2
  Bottom 0.61: JP1.1 27.18,41.6 v27.18,43.43
N$9
  Top 0.406: R7.2 56.56,90.79 LED4.A
N$10
  Top 0.406: R8.2 48.69,90.79 LED5.A
N$11
  Top 1.778: IN.P$1 8.64,61.47 8.64,52.47 D3.C
N$12
  Top 0.813: JP37.1 35.56,34.42 35.56,35.81 34.29,37.08 29.59,37.08 28.7,37.97 28.7,39.52
N$16
  Top 0.406: 20.33,23.37 LED7.A
  Top 0.61: R10.2 20.33,23.37
N$17
  Top 0.61: R9.2 LED6.A
N$19  (via drill 0.5)
  Top 0.61: IC1.2 v9.02,21.97 11.68,19.43 IC1.11 | R10.1 15.62,23.37 v15.37,23.11
  Bottom 0.61: v9.02,21.97 10.16,23.11 v15.37,23.11
N$21  (via drill 0.5)
  Top 0.406: IC2.1 18.41,21.11 v18.41,21.84
  Top 0.61: IC1.9 v11.3,16.89 | v11.3,21.84 10.78,22.34 R15.1
  Bottom 0.61: v11.3,16.89 v11.3,21.84 15.11,21.84 15.37,22.1 18.16,22.1 v18.41,21.84
N$22  (via drill 0.8)
  Bottom 0.61: JP1.2 v26.16,38.86
  Bottom 1.016: JP37.2 30.63,34.39 v26.16,38.86
N$23
  Top 0.61: IC1.3 8.64,20.7 10.16,19.18 10.16,16.38 10.92,15.62 IC1.8
N$24  (via drill 0.5)
  Top 0.406: D4.A 15.8,21.21 v15.88,21.08 | C4.1 19.55,15.86
  Top 0.61: IC1.13 15.37,21.97 D4.A | R11.2 C4.1 | 19.55,15.86 20.32,16.64 20.32,17.65 20.7,18.03 v20.7,19.18
  Bottom 0.61: v15.88,21.08 17.78,19.18 v20.7,19.18
N$27  (via drill 0.5)
  Top 0.61: v9.02,16.89 IC1.6 | R9.1 16,25.02 v15.37,24.38
  Bottom 0.61: v15.37,24.38 14.86,24.38 14.48,24 9.53,24 8,22.48 8,17.91 v9.02,16.89
N$29
  Top 0.406: 15.04,18.16 D4.C 15.48,18.24 15.48,17.27
  Top 0.61: IC1.10 15.04,18.16 | R11.1 15.48,17.27 IC2.4
N$30
  Top 0.406: IC1.12 14.22,20.7
  Top 0.61: IC2.3 IC2.2 15.11,19.81 14.22,20.7
N$53
  Top 0.813: Q7.1 76.44,80.9 R16.2
N$54  (via drill 0.8)
  Top 1.016: Q7.3 74.34,79.59 v75.18,78.74 D16.A
  Bottom 1.27: v75.18,78.74 67.06,70.61 67.06,50.63 J6.1
N$55
  Top 0.813: Q8.1 68.56,80.9 R18.2
N$56  (via drill 0.8)
  Top 1.016: Q8.3 66.46,79.59 v67.31,78.74 D17.A
  Bottom 1.27: v67.31,78.74 64.77,76.19 J2.1
N$57
  Top 0.813: Q9.1 60.69,80.9 R20.2
N$58  (via drill 0.8)
  Top 1.016: Q9.3 58.59,79.59 v59.44,78.74 D18.A
  Bottom 1.27: v59.44,78.74 45.97,65.28 45.97,61.72 43.77,59.52 J8.1
N$59
  Top 0.813: Q10.1 52.82,80.9 R22.2
N$60  (via drill 0.8)
  Top 1.016: Q10.3 50.72,79.59 v51.56,78.74 D19.A
  Bottom 1.27: v51.56,78.74 51.56,74.93 41.4,64.77 41.4,50.63 J4.1
N$61
  Top 0.813: Q11.1 44.94,80.9 R24.2
N$62  (via drill 0.8)
  Top 1.016: Q11.3 42.84,79.59 v43.69,78.74 D20.A
  Bottom 1.27: J10.1 43.69,76.39 v43.69,78.74
N$77
  Top 0.813: U$14.P$3 77.98,81.16 R16.1
N$78
  Top 0.813: U$14.P$1 80.91,89.04 R17.2
N$80
  Top 0.813: U$13.P$3 70.1,81.16 R18.1
N$81
  Top 0.813: U$15.P$3 62.23,81.16 R20.1
N$82
  Top 0.813: R22.1 54.36,81.4 U$16.P$3
N$83
  Top 0.813: U$17.P$3 46.48,81.16 R24.1
N$85
  Top 0.813: U$13.P$1 73.04,89.04 R19.2
N$87
  Top 0.813: U$15.P$1 65.16,89.04 R21.2
N$89
  Top 0.813: U$16.P$1 57.29,89.04 R23.2
N$91
  Top 0.813: U$17.P$1 49.41,89.04 R25.2
N$104  (via drill 0.6)
  Top 0.61: 24.84,44.82 24.89,44.77 v24.89,43.43
  Top 0.813: R12.1 24.84,44.82 23.17,44.82 R86.2
  Bottom 0.61: JP1.3 24.89,41.86 v24.89,43.43
NULL
  Top 1.778: J5.1 J1.1 68.85,70.69 J9.1 | J3.1 J7.1 J9.1 | 48.77,34.29 JP4.2 48.69,34.37 47.24,35.81 47.24,62.99 54.94,70.69 J9.1
RTD+
  Top 1.016: J15.1 12.45,37.56 JP35.2
RTD-
  Top 1.016: J18.1 16,48.01 16,39 JP35.1
RX
  Top 0.406: 6.72,23.24 IC1.1 6.22,23.24 4.7,21.72
  Top 0.61: R26.1 6.72,23.24 | JP25.2 4.7,21.72
RXD1
  Top 0.61: D2.C 28.7,70.61 26.42,72.9 JP2.9
TX
  Top 0.406: 7.09,19.18 IC1.4
  Top 0.61: IC1.5 IC1.4 | JP25.3 7.09,19.18
TXD1  (via drill 0.6)
  Top 0.61: v34.8,70.61 D2.A
  Bottom 0.61: JP2.10 32,70.61 v34.8,70.61
  Bottom 0.813: JP12.4 20.32,65.02 JP2.10
(copper drawn outside any net)
  shapes: Top area x5

### Text on the board
tPlace: TTL-485 ADAPTER => | K1 | K2 | K3 | K4 | K5 | B9 | B8 | B7 | B6 | B5 | A9 | A8 | A15 | A14 | A13 | A10 | B15 | GND | BOOT | USB | <= TTL-485 ADAPTER | 470uF/25V | VIN | A0 | A1 | A2 | A3 | A4 | A5 | A6 | A7 | B10 | B11 | B13 | B14 | 3V3 | muRata | K1 | DC-DC | OKI-78SR-5 | MAX31865 | F- | K5 | K3 | RTD- | RTD+ | K2 | K4 | F+ | SS34 | B- | MAX | 485 | ESA+ | 74HC04D | A+
bPlace: 4-20mA | 0-10V | If 485 is used | 4-20mA | 0-10V | I or RTD not | A+ | B- | A+ | B- | VDC | RTD | I | AC RELAYS | +5V | GND | RT+ | RT- | F- | Iin | Ignd | NULL | K1 | K2 | K3 | K4 | K5 | LED | VCC | 4k7 | 2k4 | 4k7 | B- | 2k4 | LED | 100n | TX | TTL-485 | SM712 | RX | 120 | GND | 56k | 33p | 4k7 | A+